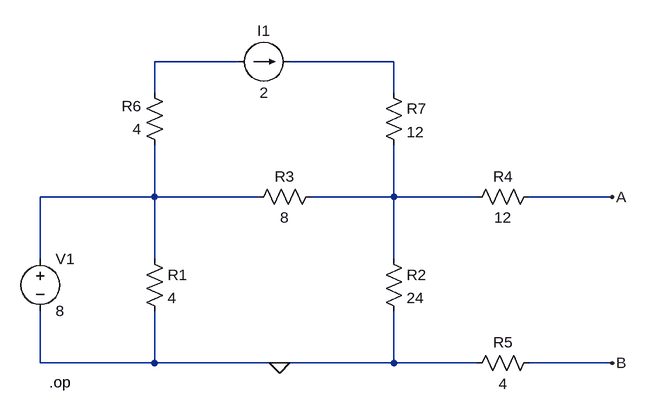
[diagram p0: schematic Draft1.asc]
Draft1.asc, the LTspice schematic file:
Version 4
SHEET 1 880 680
WIRE 0 -352 -128 -352
WIRE 240 -352 80 -352
WIRE -128 -304 -128 -352
WIRE 240 -304 240 -352
WIRE -128 -144 -128 -224
WIRE -128 -144 -304 -144
WIRE 32 -144 -128 -144
WIRE 240 -144 240 -224
WIRE 240 -144 112 -144
WIRE 368 -144 240 -144
WIRE 576 -144 448 -144
WIRE -304 -48 -304 -144
WIRE -128 -48 -128 -144
WIRE 240 -48 240 -144
WIRE -304 112 -304 32
WIRE -128 112 -128 32
WIRE -128 112 -304 112
WIRE 64 112 -128 112
WIRE 240 112 240 32
WIRE 240 112 64 112
WIRE 368 112 240 112
WIRE 576 112 448 112
FLAG 576 -144 A
FLAG 576 112 B
FLAG 64 112 0
SYMBOL res -144 -64 R0
SYMATTR InstName R1
SYMATTR Value 4
SYMBOL res 224 -64 R0
SYMATTR InstName R2
SYMATTR Value 24
SYMBOL res 128 -160 R90
WINDOW 0 0 56 VBottom 2
WINDOW 3 32 56 VTop 2
SYMATTR InstName R3
SYMATTR Value 8
SYMBOL res 464 -160 R90
WINDOW 0 0 56 VBottom 2
WINDOW 3 32 56 VTop 2
SYMATTR InstName R4
SYMATTR Value 12
SYMBOL res 464 96 R90
WINDOW 0 0 56 VBottom 2
WINDOW 3 32 56 VTop 2
SYMATTR InstName R5
SYMATTR Value 4
SYMBOL voltage -304 -64 R0
WINDOW 123 0 0 Left 0
WINDOW 39 0 0 Left 0
SYMATTR InstName V1
SYMATTR Value 8
SYMBOL res -112 -208 R180
WINDOW 0 36 76 Left 2
WINDOW 3 36 40 Left 2
SYMATTR InstName R6
SYMATTR Value 4
SYMBOL res 224 -320 R0
SYMATTR InstName R7
SYMATTR Value 12
SYMBOL current 0 -352 R270
WINDOW 0 32 40 VTop 2
WINDOW 3 -32 40 VBottom 2
WINDOW 123 0 0 Left 0
WINDOW 39 0 0 Left 0
SYMATTR InstName I1
SYMATTR Value 2
TEXT -290 142 Left 2 !.op

The netlist it stands for:
* Draft1.asc
R1 N003 0 4
R2 N004 0 24
R3 N004 N003 8
R4 A N004 12
R5 B 0 4
V1 N003 0 8
R6 N003 N001 4
R7 N002 N004 12
I1 N001 N002 2
.op
.backanno
.end